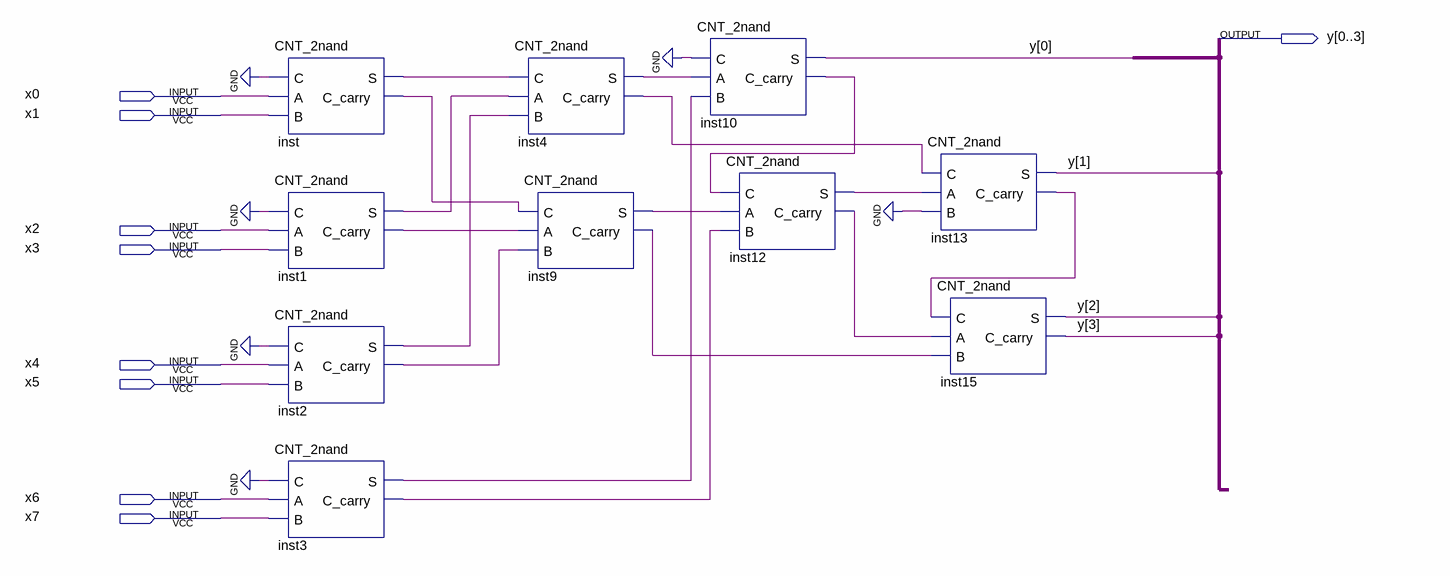
[diagram p0: schematic sheet]
// Quartus schematic Summation_of_units_8digits.bdf as structural Verilog: 10 symbols, 9 pins
module Summation_of_units_8digits (
  input  x0,
  input  x1,
  input  x2,
  input  x3,
  input  x4,
  input  x5,
  input  x6,
  input  x7,
  output [0:3] y
);

  wire inst1_c_carry, inst1_s, inst2_c_carry, inst2_s, inst3_c_carry, inst3_s, inst4_c_carry, inst4_s,
       inst9_c_carry, inst9_s, inst10_c_carry, inst12_c_carry, inst12_s, inst13_c_carry, inst_c_carry, inst_s;

  CNT_2nand inst (.C(1'b0), .A(x0), .B(x1), .S(inst_s), .C_carry(inst_c_carry));
  CNT_2nand inst1 (.C(1'b0), .A(x2), .B(x3), .S(inst1_s), .C_carry(inst1_c_carry));
  CNT_2nand inst2 (.C(1'b0), .A(x4), .B(x5), .S(inst2_s), .C_carry(inst2_c_carry));
  CNT_2nand inst3 (.C(1'b0), .A(x6), .B(x7), .S(inst3_s), .C_carry(inst3_c_carry));
  CNT_2nand inst4 (.C(inst_s), .A(inst1_s), .B(inst2_s), .S(inst4_s), .C_carry(inst4_c_carry));
  CNT_2nand inst9 (.C(inst_c_carry), .A(inst1_c_carry), .B(inst2_c_carry), .S(inst9_s), .C_carry(inst9_c_carry));
  CNT_2nand inst10 (.C(1'b0), .A(inst4_s), .B(inst3_s), .S(y[0]), .C_carry(inst10_c_carry));
  CNT_2nand inst12 (.C(inst10_c_carry), .A(inst9_s), .B(inst3_c_carry), .S(inst12_s), .C_carry(inst12_c_carry));
  CNT_2nand inst13 (.C(inst4_c_carry), .A(inst12_s), .B(1'b0), .S(y[1]), .C_carry(inst13_c_carry));
  CNT_2nand inst15 (.C(inst13_c_carry), .A(inst12_c_carry), .B(inst9_c_carry), .S(y[2]), .C_carry(y[3]));
endmodule
